# Altium schematic sheet Sheet1.SchDoc
size A4
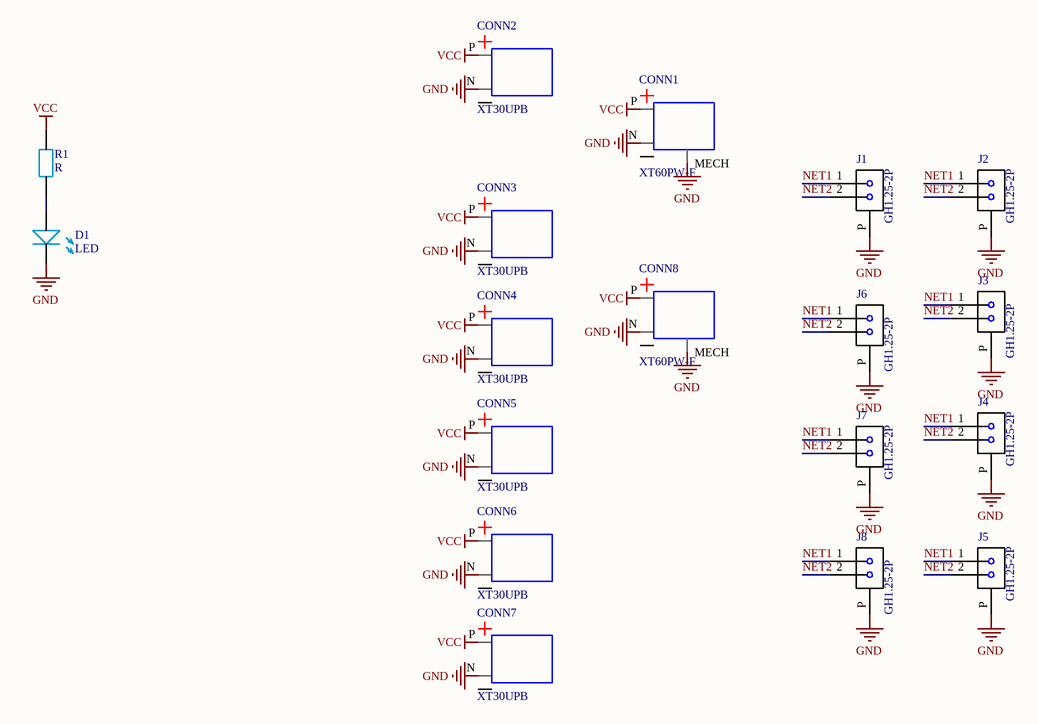
[diagram p0: Sheet1.SchDoc]

## Parts
CONN1  XT60PW-F  [XT60PW-F]
CONN2  XT30UPB  [XT30UPB]
CONN3  XT30UPB  [XT30UPB]
CONN4  XT30UPB  [XT30UPB]
CONN5  XT30UPB  [XT30UPB]
CONN6  XT30UPB  [XT30UPB]
CONN7  XT30UPB  [XT30UPB]
CONN8  XT60PW-F  [XT60PW-F]
D1  LED  [0805二极管]
J1  GH1.25-2P  [gh1.25-2p-立]
J2  GH1.25-2P  [gh1.25-2p-立]
J3  GH1.25-2P  [gh1.25-2p-立]
J4  GH1.25-2P  [gh1.25-2p-立]
J5  GH1.25-2P  [gh1.25-2p-立]
J6  GH1.25-2P  [gh1.25-2p-立]
J7  GH1.25-2P  [gh1.25-2p-立]
J8  GH1.25-2P  [gh1.25-2p-立]
R1  R  [0805_R]

## Nets
GND: CONN1.3(MECH) CONN1.N CONN2.N CONN3.N CONN4.N CONN5.N CONN6.N CONN7.N CONN8.3(MECH) CONN8.N D1.2 J1.P J2.P J3.P J4.P J5.P J6.P J7.P J8.P
VCC: CONN1.P CONN2.P CONN3.P CONN4.P CONN5.P CONN6.P CONN7.P CONN8.P R1.2
NET1: J1.1 J2.1 J3.1 J4.1 J5.1 J6.1 J7.1 J8.1
NET2: J1.2 J2.2 J3.2 J4.2 J5.2 J6.2 J7.2 J8.2
NetD1_1: D1.1 R1.1

## Library data of the parts
CONN1 CONN8 = XT60PW-F: 卧式焊板XT60（母）
CONN2-CONN7 = XT30UPB: 立式焊板XT30（通用）
J1-J8 = GH1.25-2P: MP: 53261-0271; MF: Molex; SnapEDA_Link: https://www.snapeda.com/parts/53261-0271/Molex/view-part/?ref=snap; Availability: Good; Price: 0.42 USD; Package: None; Value: *